# Altium schematic sheet Microphone-Boards_V1.0_GMA4030H11.SchDoc: Microphone-Boards
size A4; PageSetup: Record=PageOptions|CenterHorizontal=True|CenterVertical=True|PrintScale=0.97|XCorrection=1.00|YCorrection=1.00|PrintKind=0|BorderSize=5000000|LeftOffset=0|BottomOffset=0|Orientation=2|PaperLength=1000|PaperWidth=1000|Scale=100|PaperSource=7|PrintQuality=-3|MediaType=1|DitherType=10|PrintScaleMode=1|PaperKind=A4|PaperIndex=9; Organization: Ostschweizer Fachhochschule; Address2: Florian Baumgartner & Alain Keller; Address3: florian.baumgartner@ost.ch; DocumentNumber: 1; Revision: V1.0; SheetNumber: 4; SheetTotal: 5; Author: Florian Baumgartner & Alain Keller; Subtitle: GMA4030H11-F26 (Top Port)
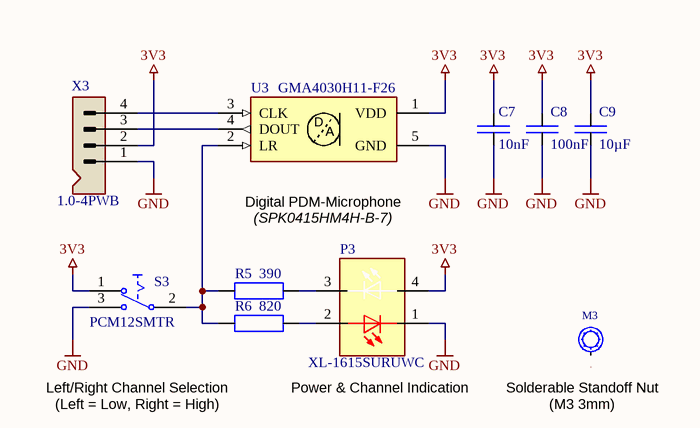
[diagram p0: Microphone-Boards_V1.0_GMA4030H11.SchDoc]

## Parts
C7  10nF  [SMD Keramikkondensator 0603]
C8  100nF  [SMD Keramikkondensator 0603]
C9  10µF  [SMD Keramikkondensator 1206]
M3  SMTSO-M3-3ET  [SMD Solder-Nut (M3 3mm)]  (value not drawn)
P3  XL-1615SURUWC  [SMD LED 0606]
R5  390  [SMD Widerstand 0603]
R6  820  [SMD Widerstand 0603]
S3  PCM12SMTR  [SMD Switch SPDT (PCM12SMTR)]
U3  GMA4030H11-F26  [SMD Microphone (GMA4030H11-F26)]
X3  1.0-4PWB  [SMD Connector (SM04B-SRSS-TB)]

## Ports
M

## Nets
3V3: C7.2 C8.2 C9.2 P3.4(WA) S3.1(NC1) U3.1(VDD) X3.2
GND: C7.1 C8.1 C9.1 P3.1(RC) S3.3(NO1) U3.5(GND) X3.1
M: M3.1 ; port M
NetP3_2: P3.2(RA) R6.2
NetP3_3: P3.3(WC) R5.2
NetR5_1: R5.1 R6.1 S3.2(COMMON1) U3.2(LR)
NetU3_3: U3.3(CLK) X3.4
NetU3_4: U3.4(DOUT) X3.3

## Notes on the sheet
- (near U3) Digital PDM-Microphone
- (SPK0415HM4H-B-7)
- Left/Right Channel Selection
- Power & Channel Indication
- (near M3) Solderable Standoff Nut
- (Left = Low, Right = High)
- (near M3) (M3 3mm)
- Title
- Author:
- Subtitle
- Date:
- Rev:
- File:
- Sheet
- of
- (in symbol U-GMA4030H11-F26) D; A

## Library data of the parts
C7 = C-CAPACITOR: CAP-MK; Component Description: Multilayer Ceramic Capacitors; Component Value: 10nF 50V; Digikey: 445-5662-1-ND; Farnell: 2346966; Mouser: 77-VJ0603V103ZXAPBC; JLC-Parts: C57112; Unit Price: 0.01
C8 = E6 - 100nF: SMD Ceramic Capacitor E6; Component Value: 100nF 50V; Component Description: Multilayer Ceramic Capacitors MLCC; ComponentLink1Description: Datasheet; ComponentLink1URL: https://datasheet.lcsc.com/lcsc/1809301912_YAGEO-CC0603KRX7R9BB104_C14663.pdf; Digikey: 445-6899-1-ND; Farnell: 2210822; JLC-Parts: C14663; Mouser: 810-CGA2B3X7R1H104K; Unit Price: 0.01
C9 = E6 - 10uF: SMD Ceramic Capacitor E6; Component Value: 10µF 50V; Component Description: Multilayer Ceramic Capacitors MLCC; ComponentLink1Description: Datasheet; ComponentLink1URL: https://datasheet.lcsc.com/lcsc/1810191219_Samsung-Electro-Mechanics-CL10A106KP8NNNC_C19702.pdf; Digikey: 587-3258-1-ND; Farnell: 2113070; JLC-Parts: C13585; Mouser: 963-LMK107BBJ106MALT; Unit Price: 0.01
M3 = M-Spacer_M3_3mm: Solderable Standoff Nut; Component Value: M3 3mm; Mouser: 153-SMTSO-M3-3ET; Component Description: Solderable Standoff Nut; Unit Price: 0.05; JLC-Parts: C2915308; ComponentLink1Description: Datasheet; ComponentLink1URL: https://datasheet.lcsc.com/lcsc/2112061830_Sinhoo-SMTSO3030CTJ_C2915308.pdf
P3 = P-XL-1615SURUWC: LED Red/White; ComponentLink1Description: Datasheet; ComponentLink1URL: https://datasheet.lcsc.com/lcsc/2211030000_XINGLIGHT-XL-1615SURUWC_C965837.pdf; JLC-Parts: C965837; Component Description: LED Red/White; Component Value: XL-1615SURUWC; Unit Price: 0.02
R5 = R-RESISTOR: SMD-Widerstand 1/4W; Component Description: Thick Film Chip Resistor; Component Value: 390 (75V, 100mW, 1%); Digikey: P390HCT-ND; Farnell: 2303111; Mouser: 667-ERJ-3EKF3900V; JLC-Parts: C23151; Unit Price: 0.06
R6 = R-RESISTOR: SMD-Widerstand 1/4W; Component Description: Thick Film Chip Resistor; Component Value: 820 (75V, 100mW, 1%); Digikey: P820HCT-ND; Farnell: 2303136; Mouser: 667-ERJ-3EKF8200V; JLC-Parts: C23253; Unit Price: 0.06
S3 = S-PCM12SMTR: Miniature Slide Switch; aliExpress: 33002042977; Component Value: PCM12SMTR (SPDT); Digikey: 401-2016-1-ND; Mouser: 611-PCM12SMTR; Farnell: 9575146; ComponentLink1Description: Datasheet; ComponentLink1URL: https://datasheet.lcsc.com/lcsc/1912111437_SHOU-HAN-MSK12C02_C431540.pdf; JLC-Parts: C431540; Component Description: Miniature Slide Switch; Unit Price: 0.04
U3 = U-GMA4030H11-F26: Digital PDM MEMS Microphone (Top Port); Digikey: 423-1210-1-ND; Mouser: 721-SPK0415HM4H-B-7; ComponentLink1Description: Datasheet; ComponentLink1URL: https://datasheet.lcsc.com/lcsc/2005071903_INGHAi-GMA4030H11-F26_C498193.pdf; Component Description: Digital PDM MEMS Microphone (Top Port); Component Value: GMA4030H11-F26; JLC-Parts: C498193; Unit Price: 1.11
X3 = X-Stiftleiste (4-Fach): Wire To Board Connector (1x4P 1.0mm); Digikey: 455-SM04B-SRSS-TBCT-ND; Farnell: 1830839; Component Description: Wire To Board Connector (1x4P 1.0mm); Component Value: 1.0-4PWB; JLC-Parts: C2905006; Unit Price: 0.03; ComponentLink1Description: Datasheet; ComponentLink1URL: https://datasheet.lcsc.com/lcsc/2111080930_DEALON-1-0-4PWB_C2905006.pdf